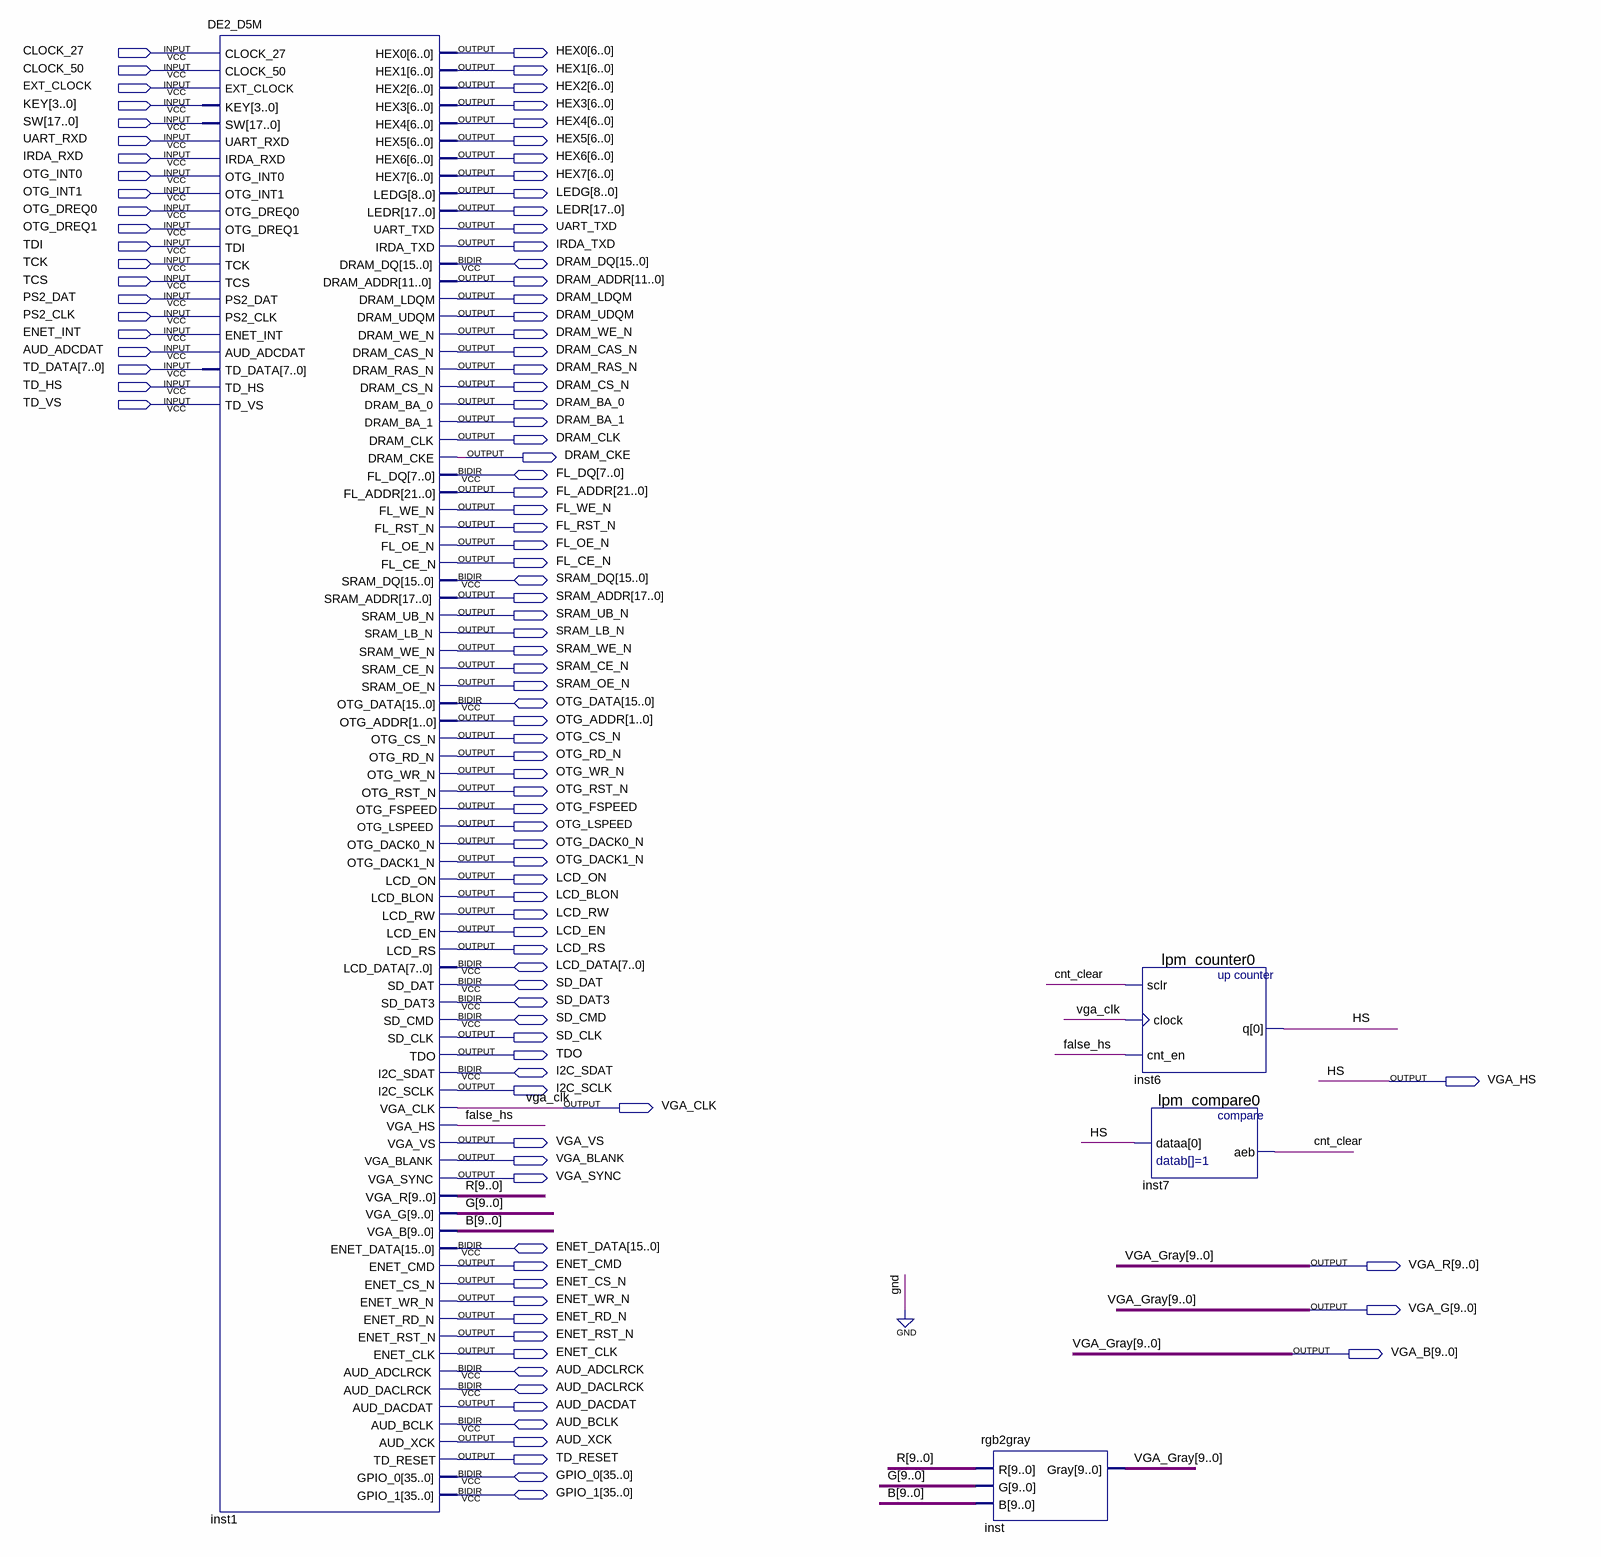
[diagram p0: schematic sheet]
// Quartus schematic mainbk.bdf as structural Verilog: 4 symbols, 104 pins
module mainbk (
  input  CLOCK_27,
  input  CLOCK_50,
  input  EXT_CLOCK,
  input  [3:0] KEY,
  input  [17:0] SW,
  input  UART_RXD,
  input  IRDA_RXD,
  input  OTG_INT0,
  input  OTG_INT1,
  input  OTG_DREQ0,
  input  OTG_DREQ1,
  input  TDI,
  input  TCK,
  input  TCS,
  input  PS2_DAT,
  input  PS2_CLK,
  input  ENET_INT,
  input  AUD_ADCDAT,
  input  [7:0] TD_DATA,
  input  TD_HS,
  input  TD_VS,
  inout  [15:0] DRAM_DQ,
  inout  [7:0] FL_DQ,
  inout  [15:0] SRAM_DQ,
  inout  [15:0] OTG_DATA,
  inout  [7:0] LCD_DATA,
  inout  SD_DAT,
  inout  SD_DAT3,
  inout  SD_CMD,
  inout  I2C_SDAT,
  inout  [15:0] ENET_DATA,
  inout  AUD_ADCLRCK,
  inout  AUD_DACLRCK,
  inout  AUD_BCLK,
  inout  [35:0] GPIO_0,
  inout  [35:0] GPIO_1,
  output [6:0] HEX0,
  output [6:0] HEX1,
  output [6:0] HEX2,
  output [6:0] HEX3,
  output [6:0] HEX4,
  output [6:0] HEX5,
  output [6:0] HEX6,
  output [6:0] HEX7,
  output [8:0] LEDG,
  output [17:0] LEDR,
  output UART_TXD,
  output IRDA_TXD,
  output [11:0] DRAM_ADDR,
  output DRAM_LDQM,
  output DRAM_UDQM,
  output DRAM_WE_N,
  output DRAM_CAS_N,
  output DRAM_RAS_N,
  output DRAM_CS_N,
  output DRAM_BA_0,
  output DRAM_BA_1,
  output DRAM_CLK,
  output DRAM_CKE,
  output [21:0] FL_ADDR,
  output FL_WE_N,
  output FL_RST_N,
  output FL_OE_N,
  output FL_CE_N,
  output [17:0] SRAM_ADDR,
  output SRAM_UB_N,
  output SRAM_LB_N,
  output SRAM_WE_N,
  output SRAM_CE_N,
  output SRAM_OE_N,
  output [1:0] OTG_ADDR,
  output OTG_CS_N,
  output OTG_RD_N,
  output OTG_WR_N,
  output OTG_RST_N,
  output OTG_FSPEED,
  output OTG_LSPEED,
  output OTG_DACK0_N,
  output OTG_DACK1_N,
  output LCD_ON,
  output LCD_BLON,
  output LCD_RW,
  output LCD_EN,
  output LCD_RS,
  output SD_CLK,
  output TDO,
  output VGA_HS,
  output I2C_SCLK,
  output VGA_CLK,
  output VGA_VS,
  output VGA_BLANK,
  output VGA_SYNC,
  output ENET_CMD,
  output [9:0] VGA_R,
  output ENET_CS_N,
  output ENET_WR_N,
  output [9:0] VGA_G,
  output ENET_RD_N,
  output ENET_RST_N,
  output ENET_CLK,
  output [9:0] VGA_B,
  output AUD_DACDAT,
  output AUD_XCK,
  output TD_RESET
);

  wire cnt_clear, false_hs;
  wire [9:0] B, G, R;

  DE2_D5M inst1 (
    .CLOCK_27(CLOCK_27), .CLOCK_50(CLOCK_50), .EXT_CLOCK(EXT_CLOCK), .KEY(KEY), .SW(SW), .UART_RXD(UART_RXD),
    .IRDA_RXD(IRDA_RXD), .OTG_INT0(OTG_INT0), .OTG_INT1(OTG_INT1), .OTG_DREQ0(OTG_DREQ0),
    .OTG_DREQ1(OTG_DREQ1), .TDI(TDI), .TCK(TCK), .TCS(TCS), .PS2_DAT(PS2_DAT), .PS2_CLK(PS2_CLK),
    .ENET_INT(ENET_INT), .AUD_ADCDAT(AUD_ADCDAT), .TD_DATA(TD_DATA), .TD_HS(TD_HS), .TD_VS(TD_VS),
    .HEX0(HEX0), .HEX1(HEX1), .HEX2(HEX2), .HEX3(HEX3), .HEX4(HEX4), .HEX5(HEX5), .HEX6(HEX6), .HEX7(HEX7),
    .LEDG(LEDG), .LEDR(LEDR), .UART_TXD(UART_TXD), .IRDA_TXD(IRDA_TXD), .DRAM_ADDR(DRAM_ADDR),
    .DRAM_LDQM(DRAM_LDQM), .DRAM_UDQM(DRAM_UDQM), .DRAM_WE_N(DRAM_WE_N), .DRAM_CAS_N(DRAM_CAS_N),
    .DRAM_RAS_N(DRAM_RAS_N), .DRAM_CS_N(DRAM_CS_N), .DRAM_BA_0(DRAM_BA_0), .DRAM_BA_1(DRAM_BA_1),
    .DRAM_CLK(DRAM_CLK), .DRAM_CKE(DRAM_CKE), .FL_ADDR(FL_ADDR), .FL_WE_N(FL_WE_N), .FL_RST_N(FL_RST_N),
    .FL_OE_N(FL_OE_N), .FL_CE_N(FL_CE_N), .SRAM_ADDR(SRAM_ADDR), .SRAM_UB_N(SRAM_UB_N),
    .SRAM_LB_N(SRAM_LB_N), .SRAM_WE_N(SRAM_WE_N), .SRAM_CE_N(SRAM_CE_N), .SRAM_OE_N(SRAM_OE_N),
    .OTG_ADDR(OTG_ADDR), .OTG_CS_N(OTG_CS_N), .OTG_RD_N(OTG_RD_N), .OTG_WR_N(OTG_WR_N),
    .OTG_RST_N(OTG_RST_N), .OTG_FSPEED(OTG_FSPEED), .OTG_LSPEED(OTG_LSPEED), .OTG_DACK0_N(OTG_DACK0_N),
    .OTG_DACK1_N(OTG_DACK1_N), .LCD_ON(LCD_ON), .LCD_BLON(LCD_BLON), .LCD_RW(LCD_RW), .LCD_EN(LCD_EN),
    .LCD_RS(LCD_RS), .SD_CLK(SD_CLK), .TDO(TDO), .I2C_SCLK(I2C_SCLK), .VGA_CLK(VGA_CLK), .VGA_HS(false_hs),
    .VGA_VS(VGA_VS), .VGA_BLANK(VGA_BLANK), .VGA_SYNC(VGA_SYNC), .VGA_R(R), .VGA_G(G), .VGA_B(B),
    .ENET_CMD(ENET_CMD), .ENET_CS_N(ENET_CS_N), .ENET_WR_N(ENET_WR_N), .ENET_RD_N(ENET_RD_N),
    .ENET_RST_N(ENET_RST_N), .ENET_CLK(ENET_CLK), .AUD_DACDAT(AUD_DACDAT), .AUD_XCK(AUD_XCK),
    .TD_RESET(TD_RESET), .DRAM_DQ(DRAM_DQ), .FL_DQ(FL_DQ), .SRAM_DQ(SRAM_DQ), .OTG_DATA(OTG_DATA),
    .LCD_DATA(LCD_DATA), .SD_DAT(SD_DAT), .SD_DAT3(SD_DAT3), .SD_CMD(SD_CMD), .I2C_SDAT(I2C_SDAT),
    .ENET_DATA(ENET_DATA), .AUD_ADCLRCK(AUD_ADCLRCK), .AUD_DACLRCK(AUD_DACLRCK), .AUD_BCLK(AUD_BCLK),
    .GPIO_0(GPIO_0), .GPIO_1(GPIO_1));
  rgb2gray inst (.R(R), .G(G), .B(B), .Gray(VGA_B));
  lpm_counter0 inst6 (.sclr(cnt_clear), .clock(VGA_CLK), .cnt_en(false_hs), .q(VGA_HS));
  lpm_compare0 inst7 (.dataa(VGA_HS), .aeb(cnt_clear));

  assign VGA_G = VGA_B;
  assign VGA_R = VGA_B;

  // Other names for the same wires on the sheet: HS = VGA_HS; VGA_Gray[9:0] = VGA_B
endmodule
